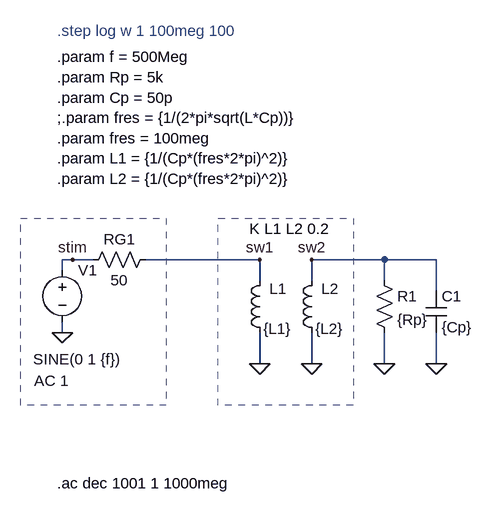
[diagram p0: schematic transform_resonant_circuit_coup .asc]
transform_resonant_circuit_coup .asc, the LTspice schematic file:
Version 4
SHEET 1 880 680
WIRE -688 -336 -704 -336
WIRE -656 -336 -688 -336
WIRE -400 -336 -576 -336
WIRE -208 -336 -320 -336
WIRE -128 -336 -208 -336
WIRE -704 -320 -704 -336
WIRE -400 -304 -400 -336
WIRE -320 -304 -320 -336
WIRE -208 -304 -208 -336
WIRE -128 -288 -128 -336
WIRE -704 -224 -704 -240
WIRE -400 -176 -400 -224
WIRE -320 -176 -320 -224
WIRE -208 -176 -208 -224
WIRE -128 -176 -128 -224
FLAG -704 -224 0
FLAG -320 -176 0
FLAG -688 -336 stim
FLAG -400 -176 0
FLAG -400 -336 sw1
FLAG -320 -336 sw2
FLAG -208 -176 0
FLAG -128 -176 0
SYMBOL voltage -704 -336 R0
WINDOW 3 -45 153 Left 2
WINDOW 123 -43 186 Left 2
WINDOW 39 0 0 Left 2
SYMATTR Value SINE(0 1 {f})
SYMATTR Value2 AC 1
SYMATTR InstName V1
SYMBOL res -560 -352 R90
WINDOW 0 0 56 VBottom 2
WINDOW 3 32 56 VTop 2
SYMATTR InstName RG1
SYMATTR Value 50
SYMBOL ind -304 -208 R180
WINDOW 0 -26 83 Left 2
WINDOW 3 10 22 Right 2
SYMATTR InstName L2
SYMATTR Value {L2}
SYMBOL res -224 -320 R0
SYMATTR InstName R1
SYMATTR Value {Rp}
SYMBOL cap -144 -288 R0
SYMATTR InstName C1
SYMATTR Value {Cp}
SYMBOL ind -384 -208 R180
WINDOW 0 -26 83 Left 2
WINDOW 3 10 22 Right 2
SYMATTR InstName L1
SYMATTR Value {L1}
TEXT -712 8 Left 2 !.ac dec 1001 1 1000meg
TEXT -712 -648 Left 2 !.param f = 500Meg\n.param Rp = 5k\n.param Cp = 50p\n;.param fres = {1/(2*pi*sqrt(L*Cp))}\n.param fres = 100meg\n.param L1 = {1/(Cp*(fres*2*pi)^2)}\n.param L2 = {1/(Cp*(fres*2*pi)^2)}
TEXT -712 -688 Left 2 ;.step log w 1 100meg 100
TEXT -416 -384 Left 2 !K L1 L2 0.2
RECTANGLE Normal -544 -112 -768 -400 2
RECTANGLE Normal -256 -112 -464 -400 2

The netlist it stands for:
* transform_resonant_circuit_coup .asc
V1 stim 0 SINE(0 1 {f}) AC 1
RG1 sw1 stim 50
L2 0 sw2 {L2}
R1 sw2 0 {Rp}
C1 sw2 0 {Cp}
L1 0 sw1 {L1}
.ac dec 1001 1 1000meg
.param f = 500Meg
.param Rp = 5k
.param Cp = 50p
;.param fres = {1/(2*pi*sqrt(L*Cp))}
.param fres = 100meg
.param L1 = {1/(Cp*(fres*2*pi)^2)}
.param L2 = {1/(Cp*(fres*2*pi)^2)}
* .step log w 1 100meg 100
K L1 L2 0.2
.backanno
.end